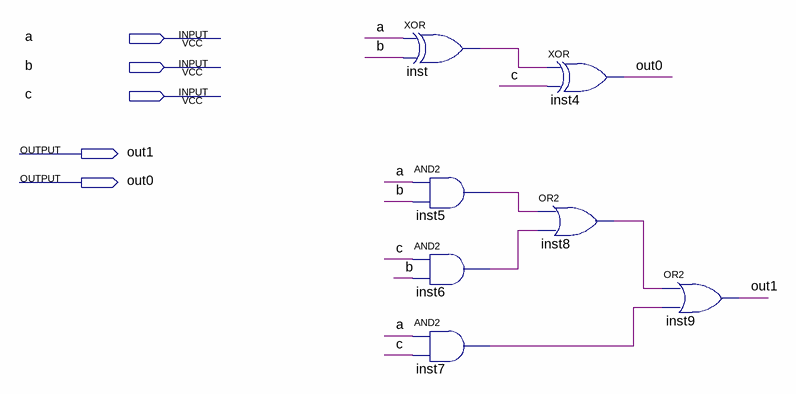
[diagram p0: schematic sheet]
// Quartus schematic FullAdder.bdf as structural Verilog: 7 symbols, 5 pins
module FullAdder (
  input  a,
  input  b,
  input  c,
  output out1,
  output out0
);

  wire inst5_out, inst6_out, inst7_out, inst8_out, inst_out;

  xor inst (inst_out, a, b);
  and inst5 (inst5_out, a, b);
  and inst6 (inst6_out, c, b);
  and inst7 (inst7_out, a, c);
  xor inst4 (out0, inst_out, c);
  or inst8 (inst8_out, inst5_out, inst6_out);
  or inst9 (out1, inst8_out, inst7_out);
endmodule
